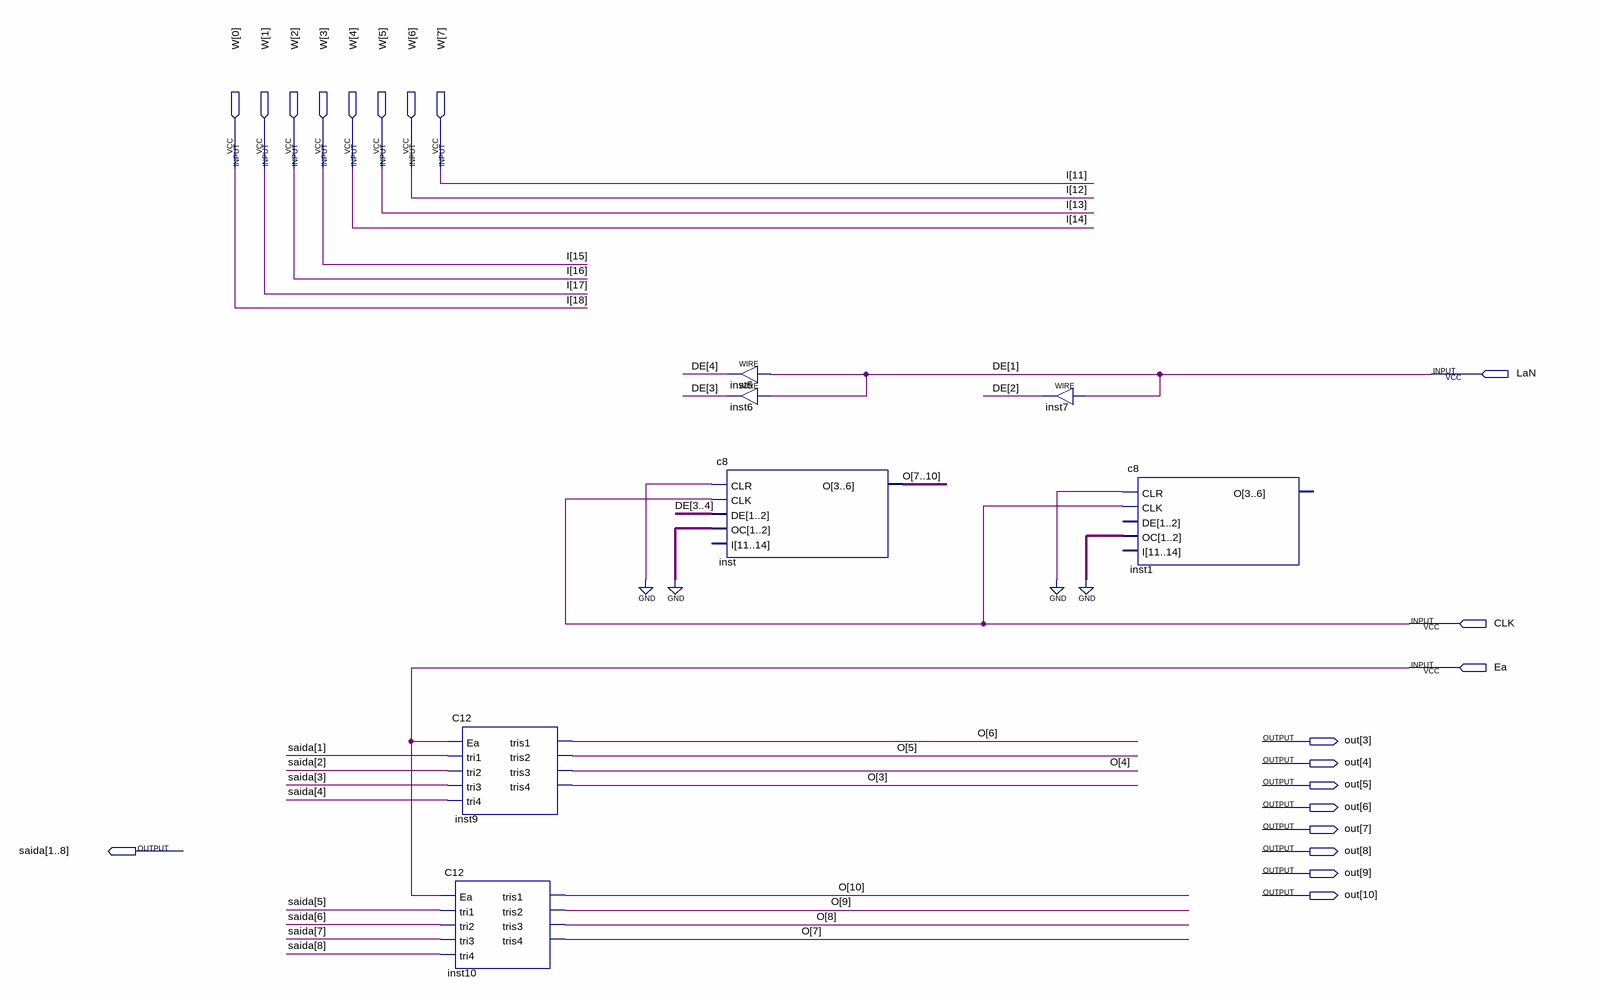
[diagram p0: schematic sheet]
// Quartus schematic AcumuladorA.bdf as structural Verilog: 7 symbols, 20 pins
module AcumuladorA (
  input  [7:0] W,
  input  LaN,
  input  CLK,
  input  Ea,
  output [10:3] out,
  output [1:8] saida
);

  wire [4:2] DE;
  wire [10:3] O;

  C12 inst10 (
    .Ea(Ea), .\tri1 (saida[5]), .tri2(saida[6]), .tri3(saida[7]), .tri4(saida[8]), .tris1(O[10]),
    .tris2(O[9]), .tris3(O[8]), .tris4(O[7]));
  C12 inst9 (
    .Ea(Ea), .\tri1 (saida[1]), .tri2(saida[2]), .tri3(saida[3]), .tri4(saida[4]), .tris1(O[6]),
    .tris2(O[5]), .tris3(O[4]), .tris4(O[3]));
  assign DE[4] = LaN;  // WIRE inst5
  assign DE[3] = LaN;  // WIRE inst6
  c8 inst (.CLR(1'b0), .CLK(CLK), .DE({DE[3], DE[4]}), .OC(2'b00), .O({O[7], O[8], O[9], O[10]}));  // open: I
  assign DE[2] = LaN;  // WIRE inst7
  c8 inst1 (.CLR(1'b0), .CLK(CLK), .OC(2'b00));  // open: DE, I, O

  // Other names for the same wires on the sheet: DE[1] = LaN;
  //   I[18:11] = {W[0], W[1], W[2], W[3], W[4], W[5], W[6], W[7]}
endmodule
